# Altium schematic sheet PowerInput.SchDoc
size A
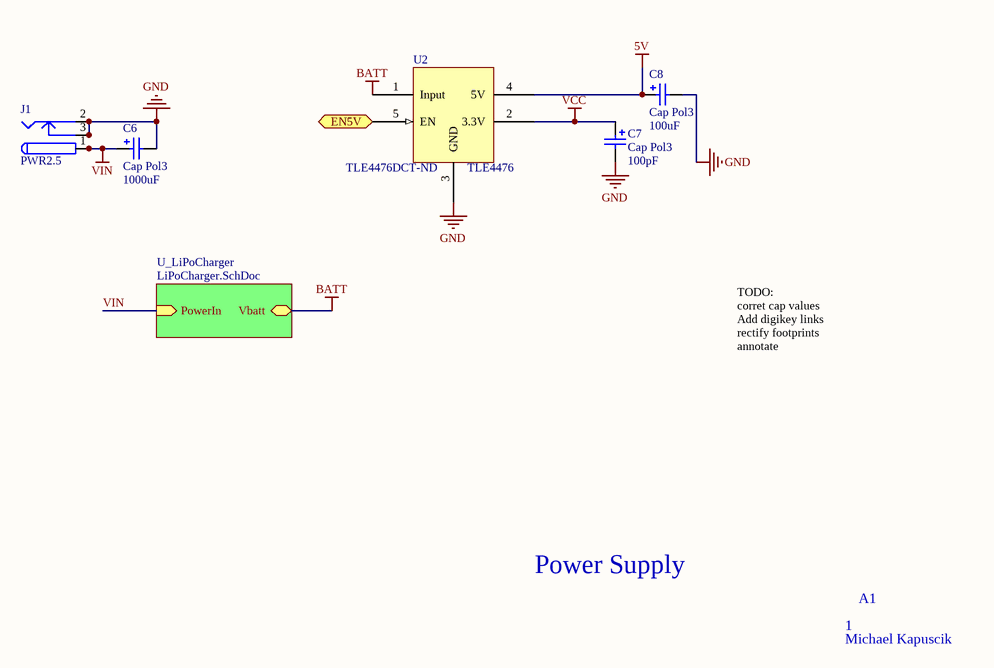
[diagram p0: PowerInput.SchDoc]

## Parts
C6  Cap Pol3  value 1000uF  [C2225]
C7  Cap Pol3  value 100pF  [C2225]
C8  Cap Pol3  value 100uF  [C2225]
J1  PWR2.5  [KLD-0202]
U2  TLE4476  Supplier Part Number 1: TLE4476DCT-ND  [P-TO252-5-1]

## Sub-sheets
U_LiPoCharger = LiPoCharger.SchDoc: Vbatt (bidir), PowerIn (in)

## Ports
EN5V (in)

## Nets
5V: C8.1 U2.4(5V)
BATT: U2.1(Input) ; sheet U_LiPoCharger/Vbatt
GND: C6.2 C7.2 C8.2 J1.2 J1.2A J1.2B J1.3 J1.3A J1.3B U2.3(GND)
VCC: C7.1 U2.2(3.3V)
VIN: C6.1 J1.1 J1.1A J1.1B ; sheet U_LiPoCharger/PowerIn
EN5V: U2.5(EN) ; port EN5V

## Notes on the sheet
- TODO:
  corret cap values
  Add digikey links
  rectify footprints
  annotate
- Power Supply
- 1
- A1
- Michael Kapuscik

## Library data of the parts
C6-C8 = Cap Pol3: Polarized Capacitor (Surface Mount); Published: 8-Jun-2000; LatestRevisionDate: 29-May-2009; LatestRevisionNote: IPC-7351 Footprint Added.; PackageReference: C0805; Publisher: Altium Limited; PackageDescription: Chip Capacitor
J1 = PWR2.5: Low Voltage Power Supply Connector; Published: 17-Dec-2003; DatasheetDocument: 09-May-2002; Publisher: Altium Limited; ComponentLink1Description: Manufacturer Link; ComponentLink1URL: http://domino.kycon.com/internet/Products.html
U2 = TLE4476: Supplier 1: Digi-Key